# Altium project kill_switch.PrjPcb
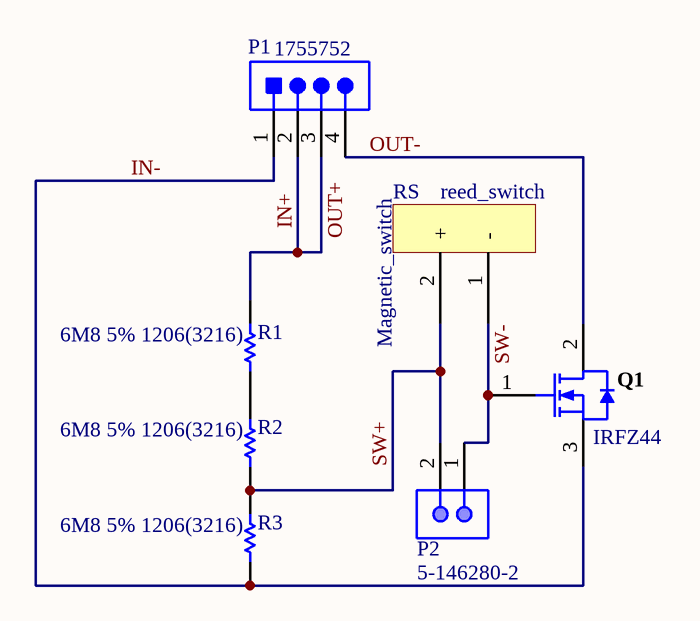
[diagram p0: kill_switch-sch.SchDoc]
1 sheet, 7 parts. Net scope: global (net labels, ports and power ports of the same name join across sheets).
Board file: kill_switch-pcb.PcbDoc

## Sheet kill_switch-sch.SchDoc
size A4

### Parts
P1  1755752  [PHOE-1755752-4_V]
P2  5-146280-2  [TECO-5-146280-2_V]
Q1  IRFZ44  [VISH-TO-220AB-3_A]
R1  6M8 5% 1206(3216)  [RESC1206(3216)_L]
R2  6M8 5% 1206(3216)  [RESC1206(3216)_L]
R3  6M8 5% 1206(3216)  [RESC1206(3216)_L]
RS  Magnetic_switch  [Reed_switch]

### Nets
IN+: P1.2 P1.3 R1.2  [also labelled OUT+]
IN-: P1.1 Q1.3(S) R3.1
OUT-: P1.4 Q1.2(D)
SW+: P2.2 R2.1 R3.2 RS.2(+)
SW-: P2.1 Q1.1(G) RS.1(-)
NetR1_1: R1.1 R2.2

### Library data of the parts
P1 = CMP-2000-05301-1: Male Header, Pitch 5.08 mm, 1 x 4 Position, Height 12 mm, Tail Length 3.9 mm, 4-Pin THD, RoHS, Bulk; Manufacturer: Phoenix Contact; Pitch: 5.08mm; Number of contacts: 4; Industrial packaging: Yes; Content: 250pc(s); Manufacturer URL: http://www.phoenixcontact.com/; Datasheet URL: https://datasheet.ciiva.com/29210/569389-da-01-en-grundgehaeuse-1755752-250-st-29210608.pdf; Colour: Green; Datasheet Version: Nov-13; Type: MSTBVA2,5/4-G-5,08; Manufacturer part No.: 1755752
P2 = CMP-2000-07492-1: Male Header, Pitch 2.54 mm, 1 x 2 Position, Height 8.21 mm, Tail Length 3.05 mm, -65 to 105 degC, RoHS, Bulk; Manufacturer: TE Connectivity; Mating Connector Lock: No(Without); Number of Positions: 2; Pitch: 2.54mm; PCB Mounting Orientation: Vertical; Keyed: No; Case\/Package: 100; Mating Post Length: 0.23inch; High Temperature Housing: Yes; Max Current Rating: 5A; PCB Thickness: 0.063inch; PCB Mount Retention: Without; Approvals: CSA; Current Rating: 3A; Radiation Hardening: No; Length: 4.67mm; Contact Mating Length: 0.23inch; Connector Type: Header; Number of Rows: 1; Termination Post Length: 0.12inch; Board Standoff: No(Without); Max Operating Temperature: 105degC; Contact Shape: Square; Selectively Loaded: No(Without); Gasket: No(Without); Number of Contacts: 2; Contact Gender: Male; Mating Alignment: No(Without); Manufacturer URL: http://www.te.com/; Datasheet URL: http://www.te.com/commerce/DocumentDelivery/DDEController?Action=showdoc&DocId=Customer+Drawing%7F146280%7FH1%7Fpdf%7FEnglish%7FENG_CD_146280_H1.pdf%7F5-146280-2; Mount: ThroughHole; Orientation: Straight; Packaging: Carton; Package Reference: 5-146280-2; Package Quantity: 500; Stabilizers: No(Without); Row Spacing: 2.54mm; Contact Material: CopperAlloy; Panel Mount Retention: No(Without); Datasheet Version: Rev. H1, 08/2016; Housing Colour: Black; Colour: Black; Package Description: Male Header, Pitch 2.54 mm, 1 x 2 Position, Height 8.21 mm, Tail Length 3.05 mm; Contact Plating: Matte; Housing Material: Polymer; Contact Protection: No(Without); Min Operating Temperature: -65degC; Mounting Technology: ThroughHole; Flammability Rating: UL94V-0; RoHSCompliant: true; Termination: ThroughHole; Depth: 2.34mm; High Speed Serial Data Connector: No
Q1 = CMP-2000-06461-1: Power MOSFET, 100 VDS, -55 to 175 degC, 3-Pin TO-220AB, RoHS, Tube; Manufacturer: Vishay; Typical Turn-Off Delay Time: 53ns; Channel Mode: Enhancement; Unit Weight: 0.211644oz; Transistor Type: 1N-Channel; Vgs - Gate-Source Voltage: 20V; Transistor Polarity: N-Channel; Vds - Drain-Source Breakdown Voltage: 100V; Configuration: Single; Number of Channels: 1Channel; Pd - Power Dissipation: 150W; Brand: VishaySemiconductors; Rds On - Drain-Source Resistance: 77mOhms; Id - Continuous Drain Current: 28A; Rise Time: 44ns; Fall Time: 43ns; Typical Turn-On Delay Time: 11ns; &lt;PCN&gt;: http://www.mouser.com/PCN/Vishay_SIL_0182015.pdf; Maximum Operating Temperature: +175C; Product Category: MOSFET; Datasheet URL: http://www.vishay.com/docs/91021/91021.pdf; Length: 10.51mm; Height: 9.01mm; Factory Pack Quantity: 50; Width: 4.7mm; Packaging: Tube; Package Reference: TO-220AB-3; Package / Case: TO-220-3; Mounting Style: ThroughHole; Manufacturer URL: http://www.vishay.com/; Mounting Technology: ThroughHole; Package URL: http://www.vishay.com/docs/71195/to220ab.pdf; RoHS: NoRoHSVersionAvailable; Technology: Si; Minimum Operating Temperature: -55C; Package Description: 3-Pin Flange Mount, Body 10.275 x 4.45 mm, Pitch 2.54 mm; Datasheet Version: Rev. B, 03/2011
R1-R3 = CMP-1014-00166-1: 6M8 0.25W 5% 1206 (3216 Metric)  SMD; Case-Metric: 3216; Case-EIA: 1206; Value: 6800000.00 Ohm; Tolerance: 5 %; Power: 0.25 W; Technology: SMT
RS = Component_1: Catergories: reed_switch